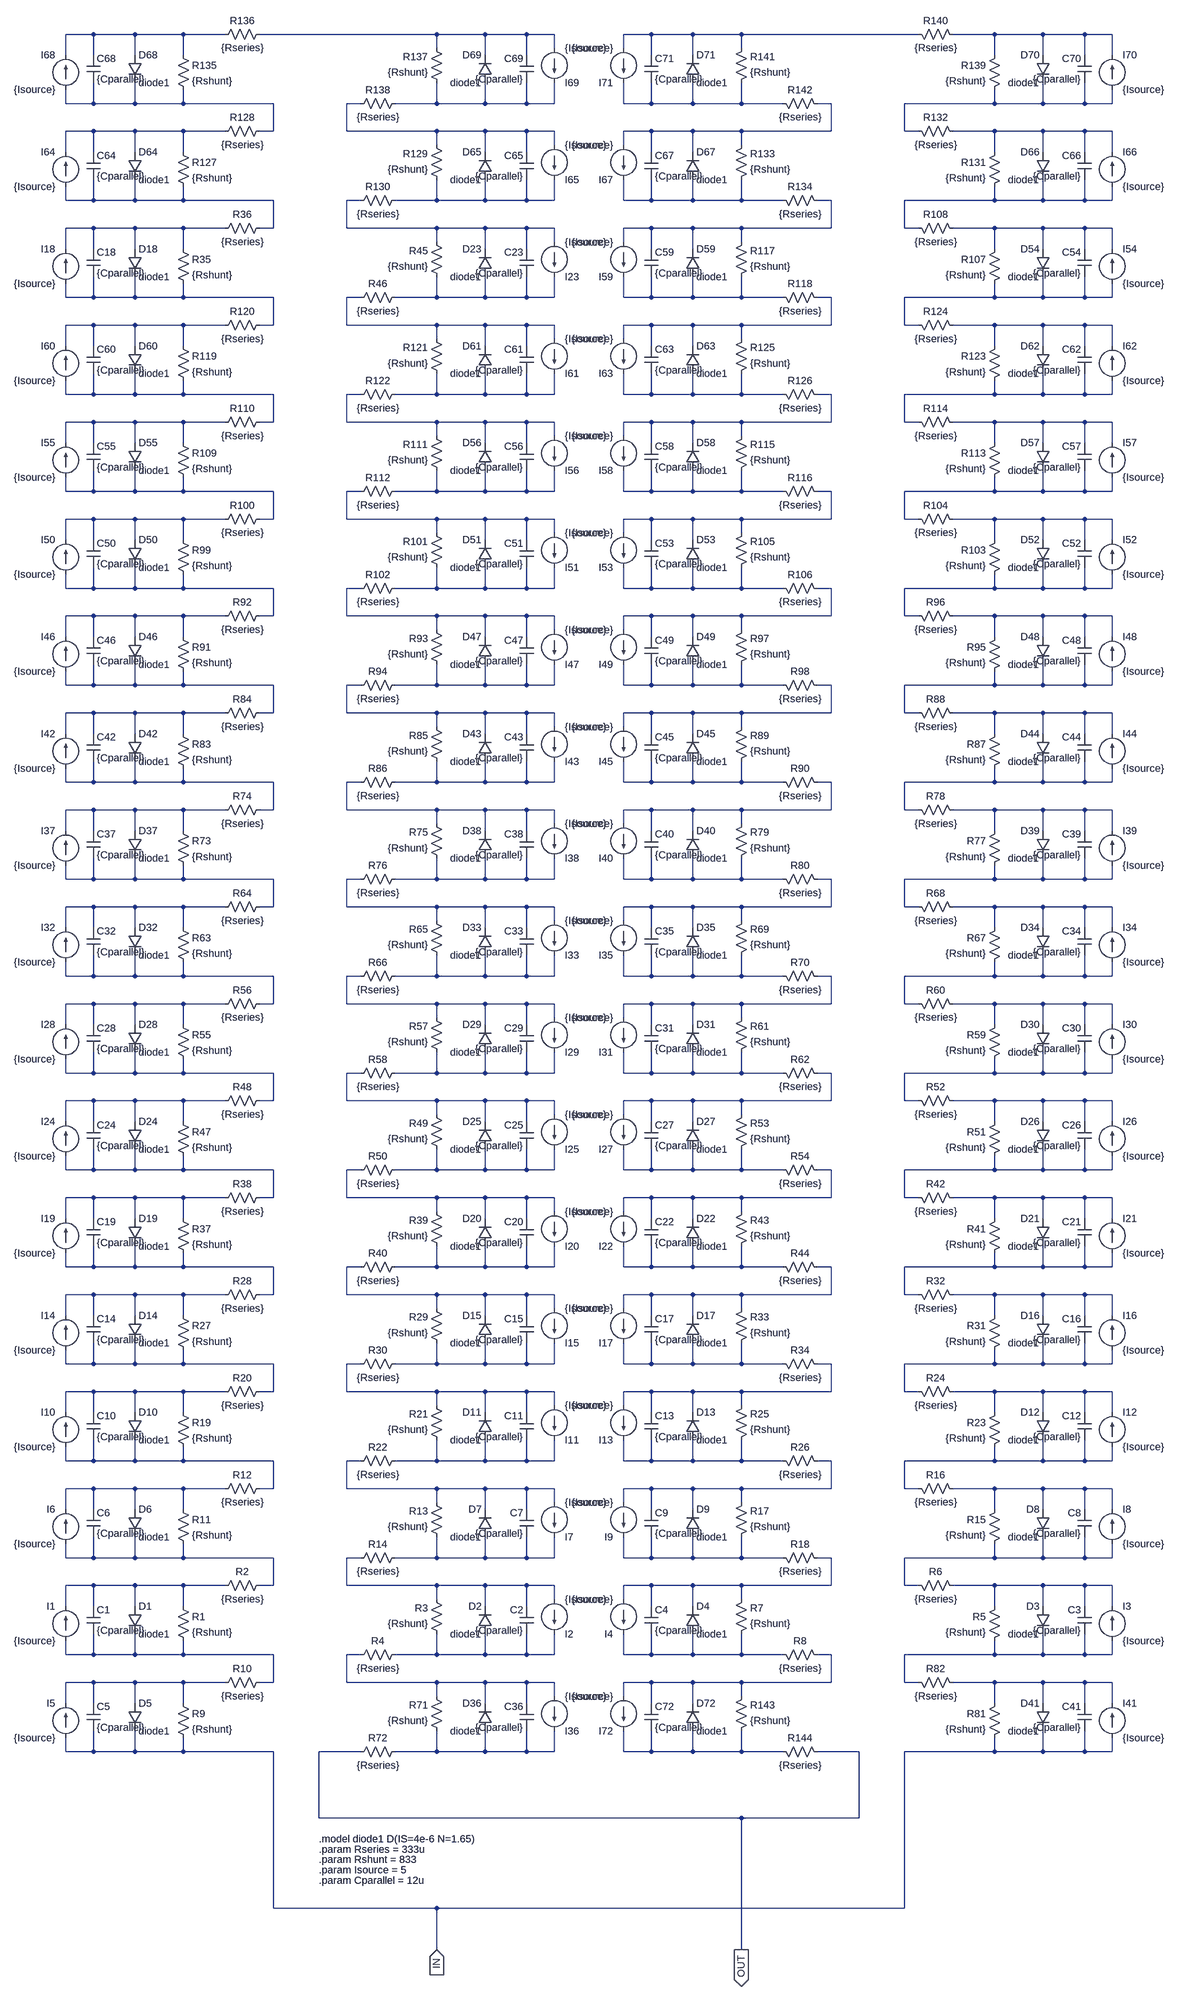
[diagram p0: schematic module-72cells.asc]
* module-72cells.asc
I5 IN N139 {Isource}
C5 N139 IN {Cparallel}
D5 N139 IN diode1
R9 N139 IN {Rshunt}
R10 N133 N139 {Rseries}
I36 N134 N141 {Isource}
C36 N141 N134 {Cparallel}
D36 N141 N134 diode1
R71 N141 N134 {Rshunt}
R72 OUT N141 {Rseries}
I41 IN N140 {Isource}
C41 N140 IN {Cparallel}
D41 N140 IN diode1
R81 N140 IN {Rshunt}
R82 N138 N140 {Rseries}
I72 N137 N142 {Isource}
C72 N142 N137 {Cparallel}
D72 N142 N137 diode1
R143 N142 N137 {Rshunt}
R144 OUT N142 {Rseries}
I1 N133 N131 {Isource}
C1 N131 N133 {Cparallel}
D1 N131 N133 diode1
R1 N131 N133 {Rshunt}
R2 N125 N131 {Rseries}
I2 N126 N135 {Isource}
C2 N135 N126 {Cparallel}
D2 N135 N126 diode1
R3 N135 N126 {Rshunt}
R4 N134 N135 {Rseries}
I3 N138 N132 {Isource}
C3 N132 N138 {Cparallel}
D3 N132 N138 diode1
R5 N132 N138 {Rshunt}
R6 N130 N132 {Rseries}
I4 N129 N136 {Isource}
C4 N136 N129 {Cparallel}
D4 N136 N129 diode1
R7 N136 N129 {Rshunt}
R8 N137 N136 {Rseries}
I6 N125 N123 {Isource}
C6 N123 N125 {Cparallel}
D6 N123 N125 diode1
R11 N123 N125 {Rshunt}
R12 N117 N123 {Rseries}
I7 N118 N127 {Isource}
C7 N127 N118 {Cparallel}
D7 N127 N118 diode1
R13 N127 N118 {Rshunt}
R14 N126 N127 {Rseries}
I8 N130 N124 {Isource}
C8 N124 N130 {Cparallel}
D8 N124 N130 diode1
R15 N124 N130 {Rshunt}
R16 N122 N124 {Rseries}
I9 N121 N128 {Isource}
C9 N128 N121 {Cparallel}
D9 N128 N121 diode1
R17 N128 N121 {Rshunt}
R18 N129 N128 {Rseries}
I10 N117 N115 {Isource}
C10 N115 N117 {Cparallel}
D10 N115 N117 diode1
R19 N115 N117 {Rshunt}
R20 N109 N115 {Rseries}
I11 N110 N119 {Isource}
C11 N119 N110 {Cparallel}
D11 N119 N110 diode1
R21 N119 N110 {Rshunt}
R22 N118 N119 {Rseries}
I12 N122 N116 {Isource}
C12 N116 N122 {Cparallel}
D12 N116 N122 diode1
R23 N116 N122 {Rshunt}
R24 N114 N116 {Rseries}
I13 N113 N120 {Isource}
C13 N120 N113 {Cparallel}
D13 N120 N113 diode1
R25 N120 N113 {Rshunt}
R26 N121 N120 {Rseries}
I14 N109 N107 {Isource}
C14 N107 N109 {Cparallel}
D14 N107 N109 diode1
R27 N107 N109 {Rshunt}
R28 N101 N107 {Rseries}
I15 N102 N111 {Isource}
C15 N111 N102 {Cparallel}
D15 N111 N102 diode1
R29 N111 N102 {Rshunt}
R30 N110 N111 {Rseries}
I16 N114 N108 {Isource}
C16 N108 N114 {Cparallel}
D16 N108 N114 diode1
R31 N108 N114 {Rshunt}
R32 N106 N108 {Rseries}
I17 N105 N112 {Isource}
C17 N112 N105 {Cparallel}
D17 N112 N105 diode1
R33 N112 N105 {Rshunt}
R34 N113 N112 {Rseries}
I19 N101 N099 {Isource}
C19 N099 N101 {Cparallel}
D19 N099 N101 diode1
R37 N099 N101 {Rshunt}
R38 N093 N099 {Rseries}
I20 N094 N103 {Isource}
C20 N103 N094 {Cparallel}
D20 N103 N094 diode1
R39 N103 N094 {Rshunt}
R40 N102 N103 {Rseries}
I21 N106 N100 {Isource}
C21 N100 N106 {Cparallel}
D21 N100 N106 diode1
R41 N100 N106 {Rshunt}
R42 N098 N100 {Rseries}
I22 N097 N104 {Isource}
C22 N104 N097 {Cparallel}
D22 N104 N097 diode1
R43 N104 N097 {Rshunt}
R44 N105 N104 {Rseries}
I24 N093 N091 {Isource}
C24 N091 N093 {Cparallel}
D24 N091 N093 diode1
R47 N091 N093 {Rshunt}
R48 N085 N091 {Rseries}
I25 N086 N095 {Isource}
C25 N095 N086 {Cparallel}
D25 N095 N086 diode1
R49 N095 N086 {Rshunt}
R50 N094 N095 {Rseries}
I26 N098 N092 {Isource}
C26 N092 N098 {Cparallel}
D26 N092 N098 diode1
R51 N092 N098 {Rshunt}
R52 N090 N092 {Rseries}
I27 N089 N096 {Isource}
C27 N096 N089 {Cparallel}
D27 N096 N089 diode1
R53 N096 N089 {Rshunt}
R54 N097 N096 {Rseries}
I28 N085 N083 {Isource}
C28 N083 N085 {Cparallel}
D28 N083 N085 diode1
R55 N083 N085 {Rshunt}
R56 N077 N083 {Rseries}
I29 N078 N087 {Isource}
C29 N087 N078 {Cparallel}
D29 N087 N078 diode1
R57 N087 N078 {Rshunt}
R58 N086 N087 {Rseries}
I30 N090 N084 {Isource}
C30 N084 N090 {Cparallel}
D30 N084 N090 diode1
R59 N084 N090 {Rshunt}
R60 N082 N084 {Rseries}
I31 N081 N088 {Isource}
C31 N088 N081 {Cparallel}
D31 N088 N081 diode1
R61 N088 N081 {Rshunt}
R62 N089 N088 {Rseries}
I32 N077 N075 {Isource}
C32 N075 N077 {Cparallel}
D32 N075 N077 diode1
R63 N075 N077 {Rshunt}
R64 N069 N075 {Rseries}
I33 N070 N079 {Isource}
C33 N079 N070 {Cparallel}
D33 N079 N070 diode1
R65 N079 N070 {Rshunt}
R66 N078 N079 {Rseries}
I34 N082 N076 {Isource}
C34 N076 N082 {Cparallel}
D34 N076 N082 diode1
R67 N076 N082 {Rshunt}
R68 N074 N076 {Rseries}
I35 N073 N080 {Isource}
C35 N080 N073 {Cparallel}
D35 N080 N073 diode1
R69 N080 N073 {Rshunt}
R70 N081 N080 {Rseries}
I37 N069 N067 {Isource}
C37 N067 N069 {Cparallel}
D37 N067 N069 diode1
R73 N067 N069 {Rshunt}
R74 N061 N067 {Rseries}
I38 N062 N071 {Isource}
C38 N071 N062 {Cparallel}
D38 N071 N062 diode1
R75 N071 N062 {Rshunt}
R76 N070 N071 {Rseries}
I39 N074 N068 {Isource}
C39 N068 N074 {Cparallel}
D39 N068 N074 diode1
R77 N068 N074 {Rshunt}
R78 N066 N068 {Rseries}
I40 N065 N072 {Isource}
C40 N072 N065 {Cparallel}
D40 N072 N065 diode1
R79 N072 N065 {Rshunt}
R80 N073 N072 {Rseries}
I42 N061 N059 {Isource}
C42 N059 N061 {Cparallel}
D42 N059 N061 diode1
R83 N059 N061 {Rshunt}
R84 N053 N059 {Rseries}
I43 N054 N063 {Isource}
C43 N063 N054 {Cparallel}
D43 N063 N054 diode1
R85 N063 N054 {Rshunt}
R86 N062 N063 {Rseries}
I44 N066 N060 {Isource}
C44 N060 N066 {Cparallel}
D44 N060 N066 diode1
R87 N060 N066 {Rshunt}
R88 N058 N060 {Rseries}
I45 N057 N064 {Isource}
C45 N064 N057 {Cparallel}
D45 N064 N057 diode1
R89 N064 N057 {Rshunt}
R90 N065 N064 {Rseries}
I46 N053 N051 {Isource}
C46 N051 N053 {Cparallel}
D46 N051 N053 diode1
R91 N051 N053 {Rshunt}
R92 N045 N051 {Rseries}
I47 N046 N055 {Isource}
C47 N055 N046 {Cparallel}
D47 N055 N046 diode1
R93 N055 N046 {Rshunt}
R94 N054 N055 {Rseries}
I48 N058 N052 {Isource}
C48 N052 N058 {Cparallel}
D48 N052 N058 diode1
R95 N052 N058 {Rshunt}
R96 N050 N052 {Rseries}
I49 N049 N056 {Isource}
C49 N056 N049 {Cparallel}
D49 N056 N049 diode1
R97 N056 N049 {Rshunt}
R98 N057 N056 {Rseries}
I50 N045 N043 {Isource}
C50 N043 N045 {Cparallel}
D50 N043 N045 diode1
R99 N043 N045 {Rshunt}
R100 N037 N043 {Rseries}
I51 N038 N047 {Isource}
C51 N047 N038 {Cparallel}
D51 N047 N038 diode1
R101 N047 N038 {Rshunt}
R102 N046 N047 {Rseries}
I52 N050 N044 {Isource}
C52 N044 N050 {Cparallel}
D52 N044 N050 diode1
R103 N044 N050 {Rshunt}
R104 N042 N044 {Rseries}
I53 N041 N048 {Isource}
C53 N048 N041 {Cparallel}
D53 N048 N041 diode1
R105 N048 N041 {Rshunt}
R106 N049 N048 {Rseries}
I55 N037 N035 {Isource}
C55 N035 N037 {Cparallel}
D55 N035 N037 diode1
R109 N035 N037 {Rshunt}
R110 N029 N035 {Rseries}
I56 N030 N039 {Isource}
C56 N039 N030 {Cparallel}
D56 N039 N030 diode1
R111 N039 N030 {Rshunt}
R112 N038 N039 {Rseries}
I57 N042 N036 {Isource}
C57 N036 N042 {Cparallel}
D57 N036 N042 diode1
R113 N036 N042 {Rshunt}
R114 N034 N036 {Rseries}
I58 N033 N040 {Isource}
C58 N040 N033 {Cparallel}
D58 N040 N033 diode1
R115 N040 N033 {Rshunt}
R116 N041 N040 {Rseries}
I60 N029 N027 {Isource}
C60 N027 N029 {Cparallel}
D60 N027 N029 diode1
R119 N027 N029 {Rshunt}
R120 N021 N027 {Rseries}
I61 N022 N031 {Isource}
C61 N031 N022 {Cparallel}
D61 N031 N022 diode1
R121 N031 N022 {Rshunt}
R122 N030 N031 {Rseries}
I62 N034 N028 {Isource}
C62 N028 N034 {Cparallel}
D62 N028 N034 diode1
R123 N028 N034 {Rshunt}
R124 N026 N028 {Rseries}
I63 N025 N032 {Isource}
C63 N032 N025 {Cparallel}
D63 N032 N025 diode1
R125 N032 N025 {Rshunt}
R126 N033 N032 {Rseries}
I18 N021 N019 {Isource}
C18 N019 N021 {Cparallel}
D18 N019 N021 diode1
R35 N019 N021 {Rshunt}
R36 N013 N019 {Rseries}
I23 N014 N023 {Isource}
C23 N023 N014 {Cparallel}
D23 N023 N014 diode1
R45 N023 N014 {Rshunt}
R46 N022 N023 {Rseries}
I54 N026 N020 {Isource}
C54 N020 N026 {Cparallel}
D54 N020 N026 diode1
R107 N020 N026 {Rshunt}
R108 N018 N020 {Rseries}
I59 N017 N024 {Isource}
C59 N024 N017 {Cparallel}
D59 N024 N017 diode1
R117 N024 N017 {Rshunt}
R118 N025 N024 {Rseries}
I64 N013 N011 {Isource}
C64 N011 N013 {Cparallel}
D64 N011 N013 diode1
R127 N011 N013 {Rshunt}
R128 N005 N011 {Rseries}
I65 N006 N015 {Isource}
C65 N015 N006 {Cparallel}
D65 N015 N006 diode1
R129 N015 N006 {Rshunt}
R130 N014 N015 {Rseries}
I66 N018 N012 {Isource}
C66 N012 N018 {Cparallel}
D66 N012 N018 diode1
R131 N012 N018 {Rshunt}
R132 N010 N012 {Rseries}
I67 N009 N016 {Isource}
C67 N016 N009 {Cparallel}
D67 N016 N009 diode1
R133 N016 N009 {Rshunt}
R134 N017 N016 {Rseries}
I68 N005 N001 {Isource}
C68 N001 N005 {Cparallel}
D68 N001 N005 diode1
R135 N001 N005 {Rshunt}
R136 N002 N001 {Rseries}
I69 N002 N007 {Isource}
C69 N007 N002 {Cparallel}
D69 N007 N002 diode1
R137 N007 N002 {Rshunt}
R138 N006 N007 {Rseries}
I70 N010 N004 {Isource}
C70 N004 N010 {Cparallel}
D70 N004 N010 diode1
R139 N004 N010 {Rshunt}
R140 N003 N004 {Rseries}
I71 N003 N008 {Isource}
C71 N008 N003 {Cparallel}
D71 N008 N003 diode1
R141 N008 N003 {Rshunt}
R142 N009 N008 {Rseries}
.model D D
.lib standard.dio
.model diode1 D(IS=4e-6 N=1.65)
.param Rshunt = 833
.param Rseries = 333u
.param Isource = 5
.param Cparallel = 12u
.backanno
.end